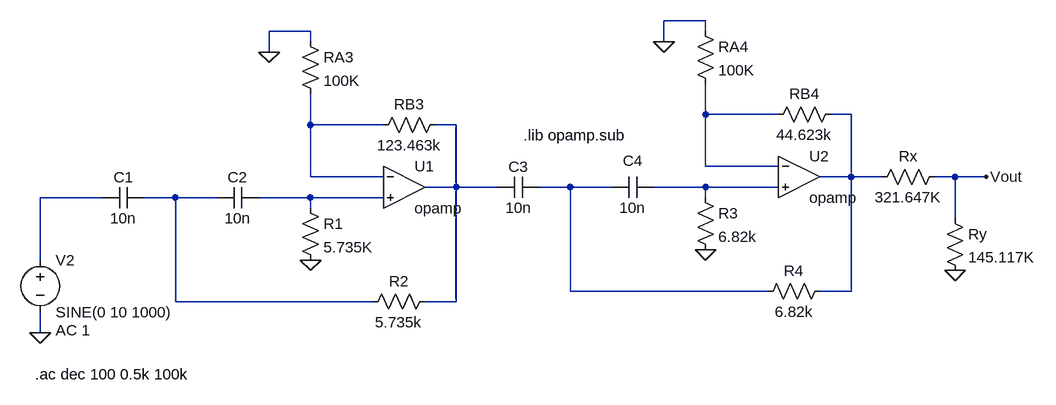
[diagram p0: schematic Passa_altas wid.asc]
Passa_altas wid.asc, the LTspice schematic file:
Version 4
SHEET 1 888 680
WIRE -1328 -32 -1392 -32
WIRE -1936 -16 -2000 -16
WIRE -1328 -16 -1328 -32
WIRE -1936 0 -1936 -16
WIRE -1392 0 -1392 -32
WIRE -2000 16 -2000 -16
WIRE -1328 112 -1328 64
WIRE -1216 112 -1328 112
WIRE -1104 112 -1136 112
WIRE -1936 128 -1936 80
WIRE -1824 128 -1936 128
WIRE -1712 128 -1744 128
WIRE -1328 192 -1328 112
WIRE -1216 192 -1328 192
WIRE -1936 208 -1936 128
WIRE -1824 208 -1936 208
WIRE -1104 208 -1104 112
WIRE -1104 208 -1152 208
WIRE -1056 208 -1104 208
WIRE -944 208 -976 208
WIRE -896 208 -944 208
WIRE -1712 224 -1712 128
WIRE -1712 224 -1760 224
WIRE -1648 224 -1712 224
WIRE -1536 224 -1584 224
WIRE -1472 224 -1536 224
WIRE -1328 224 -1408 224
WIRE -1216 224 -1328 224
WIRE -2256 240 -2352 240
WIRE -2144 240 -2192 240
WIRE -2080 240 -2144 240
WIRE -1936 240 -2016 240
WIRE -1824 240 -1936 240
WIRE -1328 240 -1328 224
WIRE -1936 256 -1936 240
WIRE -944 272 -944 208
WIRE -2352 336 -2352 240
WIRE -1536 384 -1536 224
WIRE -1232 384 -1536 384
WIRE -1104 384 -1104 208
WIRE -1104 384 -1152 384
WIRE -2144 400 -2144 240
WIRE -1840 400 -2144 400
WIRE -1712 400 -1712 224
WIRE -1712 400 -1760 400
WIRE -2352 448 -2352 416
FLAG -944 352 0
FLAG -896 208 Vout
FLAG -1936 336 0
FLAG -2000 16 0
FLAG -2352 448 0
FLAG -1328 320 0
FLAG -1392 0 0
SYMBOL res -960 256 R0
SYMATTR InstName Ry
SYMATTR Value 145.117K
SYMBOL res -960 192 R90
WINDOW 0 0 56 VBottom 2
WINDOW 3 32 56 VTop 2
SYMATTR InstName Rx
SYMATTR Value 321.647K
SYMBOL res -1952 240 R0
SYMATTR InstName R1
SYMATTR Value 5.735K
SYMBOL res -1744 384 R90
WINDOW 0 0 56 VBottom 2
WINDOW 3 32 56 VTop 2
SYMATTR InstName R2
SYMATTR Value 5.735k
SYMBOL res -1952 -16 R0
SYMATTR InstName RA3
SYMATTR Value 100K
SYMBOL res -1728 112 R90
WINDOW 0 0 56 VBottom 2
WINDOW 3 32 56 VTop 2
SYMATTR InstName RB3
SYMATTR Value 123.463k
SYMBOL cap -2192 224 R90
WINDOW 0 0 32 VBottom 2
WINDOW 3 32 32 VTop 2
SYMATTR InstName C1
SYMATTR Value 10n
SYMBOL cap -2016 224 R90
WINDOW 0 0 32 VBottom 2
WINDOW 3 32 32 VTop 2
SYMATTR InstName C2
SYMATTR Value 10n
SYMBOL voltage -2352 320 R0
WINDOW 123 24 124 Left 2
WINDOW 39 0 0 Left 0
SYMATTR Value2 AC 1
SYMATTR InstName V2
SYMATTR Value SINE(0 10 1000)
SYMBOL res -1344 224 R0
SYMATTR InstName R3
SYMATTR Value 6.82k
SYMBOL res -1136 368 R90
WINDOW 0 0 56 VBottom 2
WINDOW 3 32 56 VTop 2
SYMATTR InstName R4
SYMATTR Value 6.82k
SYMBOL res -1344 -32 R0
SYMATTR InstName RA4
SYMATTR Value 100K
SYMBOL res -1120 96 R90
WINDOW 0 0 56 VBottom 2
WINDOW 3 32 56 VTop 2
SYMATTR InstName RB4
SYMATTR Value 44.623k
SYMBOL cap -1584 208 R90
WINDOW 0 0 32 VBottom 2
WINDOW 3 32 32 VTop 2
SYMATTR InstName C3
SYMATTR Value 10n
SYMBOL cap -1408 208 R90
WINDOW 0 -9 32 VBottom 2
WINDOW 3 32 32 VTop 2
SYMATTR InstName C4
SYMATTR Value 10n
SYMBOL OpAmps\\opamp -1792 160 R0
SYMATTR InstName U1
SYMBOL OpAmps\\opamp -1184 144 R0
SYMATTR InstName U2
TEXT -2360 512 Left 2 !.ac dec 100 0.5k 100k
TEXT -1608 144 Left 2 !.lib opamp.sub

The netlist it stands for:
* Passa_altas wid.asc
Ry Vout 0 145.117K
Rx Vout N002 321.647K
R1 N009 0 5.735K
R2 N004 N008 5.735k
RA3 0 N003 100K
RB3 N004 N003 123.463k
C1 N008 N007 10n
C2 N009 N008 10n
V2 N007 0 SINE(0 10 1000) AC 1
R3 N006 0 6.82k
R4 N002 N005 6.82k
RA4 0 N001 100K
RB4 N002 N001 44.623k
C3 N005 N004 10n
C4 N006 N005 10n
XU1 N003 N009 N004 opamp Aol=100K GBW=10Meg  ; pins invin noninvin out
XU2 N001 N006 N002 opamp Aol=100K GBW=10Meg  ; pins invin noninvin out
.ac dec 100 0.5k 100k
.lib opamp.sub
.backanno
.end